# EAGLE schematic bb8 (EAGLE 6.4)
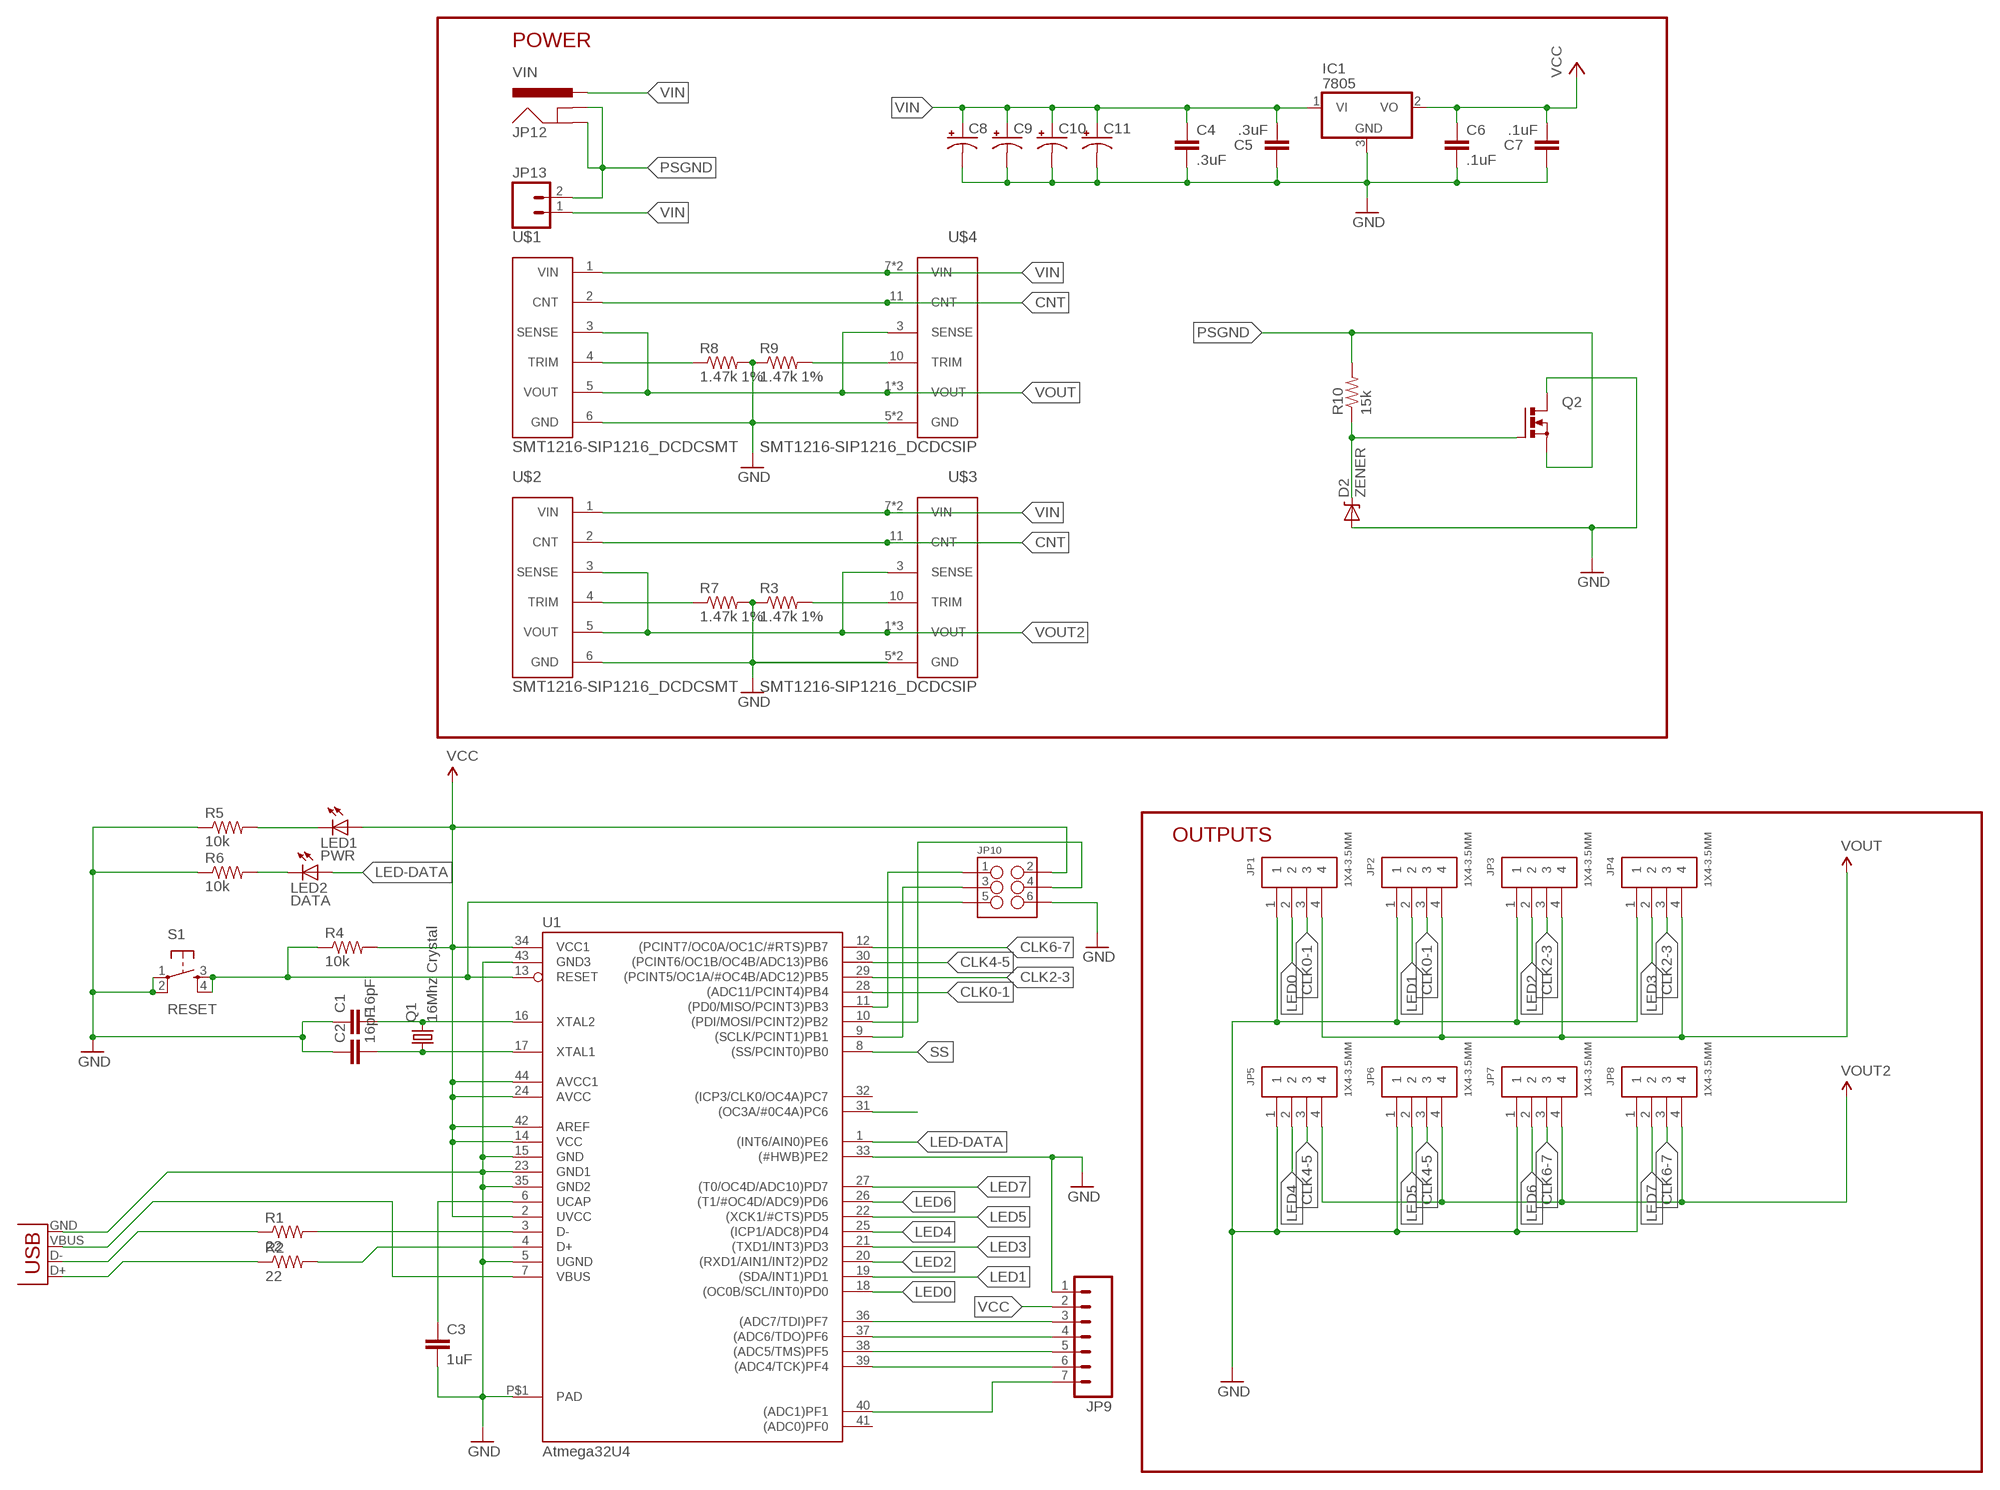
[diagram p0: schematic, sheet 1]

## Parts
C1  16pF  CAP0805  [0805]
C2  16pF  CAP0805  [0805]
C3  1uF  1UF-25V-10%(0805)  [0805]
C4  .3uF  CAP1210  [1210]
C5  .3uF  CAP0805  [0805]
C6  .1uF  CAP1210  [1210]
C7  .1uF  CAP0805  [0805]
C8  CAP_POLE  [PANASONIC_E]
C9  CAP_POLE  [PANASONIC_E]
C10  CAP_POLE  [PANASONIC_E]
C11  CAP_POLE  [PANASONIC_E]
D2  ZENER  DIODE-ZENER-BZT52  [SOD-323]
IC1  7805  7806DT  [TO252]
JP1  1X4-3.5MM  [1X04-3.5MM]
JP2  1X4-3.5MM  [1X04-3.5MM]
JP3  1X4-3.5MM  [1X04-3.5MM]
JP4  1X4-3.5MM  [1X04-3.5MM]
JP5  1X4-3.5MM  [1X04-3.5MM]
JP6  1X4-3.5MM  [1X04-3.5MM]
JP7  1X4-3.5MM  [1X04-3.5MM]
JP8  1X4-3.5MM  [1X04-3.5MM]
JP9  M07  [1X07]
JP10  M03X2POGO_PINS  [2X3_POGO]
JP11  USB-B  USBPTH  [USB-B-PTH]
JP12  VIN  POWER_JACKPTH_LOCK  [POWER_JACK_PTH_LOCK]
JP13  M025MM  [SCREWTERMINAL-5MM-2]
LED1  PWR  LED3MM  [LED3MM]
LED2  DATA  LED3MM  [LED3MM]
Q1  16Mhz Crystal  CRYSTAL  [XS3225]
Q2  PMOSFET_NTO220BV  [TO220BV]
R1  22  RESISTOR0805-RES  [0805]
R2  22  RESISTOR0805-RES  [0805]
R3  1.47k 1%  RESISTOR0805-RES  [0805]
R4  10k  RESISTOR0805-RES  [0805]
R5  10k  RESISTOR0805-RES  [0805]
R6  10k  RESISTOR0805-RES  [0805]
R7  1.47k 1%  RESISTOR0805-RES  [0805]
R8  1.47k 1%  RESISTOR0805-RES  [0805]
R9  1.47k 1%  RESISTOR0805-RES  [0805]
R10  15k  RESISTOR0805-RES  [0805]
S1  RESET  TAC_SWITCHSMD  [TACTILE_SWITCH_SMD]
U1  Atmega32U4  ARDUINO_LEONARDO-REV3B_SMARTPRJ_ATMEGA32U4-XUAU  [ARDUINO_LEONARDO-REV3B_SMARTPRJ_TQFP44-PAD]
U$1  SMT1216-SIP1216_DCDCSMT  [SMT1216_DCDC]
U$2  SMT1216-SIP1216_DCDCSMT  [SMT1216_DCDC]
U$3  SMT1216-SIP1216_DCDCSIP  [SIP1216_DCDC]
U$4  SMT1216-SIP1216_DCDCSIP  [SIP1216_DCDC]

## Nets
CLK0-1: JP1.3 JP2.3 U1.28((ADC11/PCINT4)PB4)
CLK2-3: JP3.3 JP4.3 U1.29((PCINT5/OC1A/#OC4B/ADC12)PB5)
CLK4-5: JP5.3 JP6.3 U1.30((PCINT6/OC1B/OC4B/ADC13)PB6)
CLK6-7: JP7.3 JP8.3 U1.12((PCINT7/OC0A/OC1C/#RTS)PB7)
CNT: U1.31((OC3A/#0C4A)PC6) U$1.2(CNT) U$2.2(CNT) U$3.11(CNT) U$4.11(CNT)
D2: LED1.K(C) R5.2
GND: C1.1 C2.1 C3.2 C4.2 C5.1 C6.2 C7.1 C8.- C9.- C10.- C11.- D2.2(A) IC1.3(GND) JP1.1 JP2.1 JP3.1 JP4.1 JP5.1 JP6.1 JP7.1 JP8.1 JP9.1 JP10.P$6 JP11.GND Q2.D R3.1 R5.1 R6.1 R7.2 R8.2 R9.1 S1.1 S1.2 U1.5(UGND) U1.15(GND) U1.23(GND1) U1.33((#HWB)PE2) U1.35(GND2) U1.43(GND3) U1.P$1(PAD) U$1.6(GND) U$2.6(GND) U$3.5(GND) U$3.6(GND) U$4.5(GND) U$4.6(GND)
LED0: JP1.2 U1.18((OC0B/SCL/INT0)PD0)
LED1: JP2.2 U1.19((SDA/INT1)PD1)
LED2: JP3.2 U1.20((RXD1/AIN1/INT2)PD2)
LED3: JP4.2 U1.21((TXD1/INT3)PD3)
LED4: JP5.2 U1.25((ICP1/ADC8)PD4)
LED5: JP6.2 U1.22((XCK1/#CTS)PD5)
LED6: JP7.2 U1.26((T1/#OC4D/ADC9)PD6)
LED7: JP8.2 U1.27((T0/OC4D/ADC10)PD7)
LED-DATA: LED2.A U1.1((INT6/AIN0)PE6)
MISO: JP10.P$1 U1.11((PD0/MISO/PCINT3)PB3)
MOSI: JP10.P$4 U1.10((PDI/MOSI/PCINT2)PB2)
N$1: C1.2 Q1.P$3 U1.16(XTAL2)
N$2: C2.2 Q1.P$1 U1.17(XTAL1)
N$3: R2.2 U1.4(D+)
N$4: JP11.D+ R2.1
N$5: R1.2 U1.3(D-)
N$6: JP11.D- R1.1
N$7: C3.1 U1.6(UCAP)
N$9: LED2.K(C) R6.2
N$11: JP9.3 U1.36((ADC7/TDI)PF7)
N$12: JP9.4 U1.37((ADC6/TDO)PF6)
N$13: JP9.5 U1.38((ADC5/TMS)PF5)
N$14: JP9.6 U1.39((ADC4/TCK)PF4)
N$15: JP9.7 U1.40((ADC1)PF1)
N$16: D2.1(C) Q2.G R10.1
N$17: R9.2 U$4.10(TRIM)
N$18: R7.1 U$2.4(TRIM)
N$19: R3.2 U$3.10(TRIM)
N$20: R8.1 U$1.4(TRIM)
PSGND: JP12.GND JP12.GNDBREAK JP13.2 Q2.S R10.2
RST: JP10.P$5 R4.1 S1.3 S1.4 U1.13(RESET)
SCLK: JP10.P$3 U1.9((SCLK/PCINT1)PB1)
SS: U1.8((SS/PCINT0)PB0)
VCC: C6.1 C7.2 IC1.2(VO) JP9.2 JP10.P$2 LED1.A R4.2 U1.2(UVCC) U1.14(VCC) U1.24(AVCC) U1.34(VCC1) U1.42(AREF) U1.44(AVCC1)
VIN: C4.1 C5.2 C8.+ C9.+ C10.+ C11.+ IC1.1(VI) JP12.PWR JP13.1 U$1.1(VIN) U$2.1(VIN) U$3.7(VIN) U$3.8(VIN) U$4.7(VIN) U$4.8(VIN)
VOUT: JP1.4 JP2.4 JP3.4 JP4.4 U$1.3(SENSE) U$1.5(VOUT) U$4.1(VOUT) U$4.2(VOUT) U$4.3(SENSE) U$4.4(VOUT)
VOUT2: JP5.4 JP6.4 JP7.4 JP8.4 U$2.3(SENSE) U$2.5(VOUT) U$3.1(VOUT) U$3.2(VOUT) U$3.3(SENSE) U$3.4(VOUT)
VUSB: JP11.VBUS U1.7(VBUS)
Unconnected: U1.32((ICP3/CLK0/OC4A)PC7) U1.41((ADC0)PF0)

## Notes on the sheet
- POWER
- OUTPUTS

## Library data of the parts
C1 C2 = SparkFun-Passives:CAP: Capacitor Standard 0603 ceramic capacitor, and 0.1" leaded capacitor.
C3 = SparkFun-Capacitors:1UF-25V-10%(0805): CAP-08064; PROD_ID: CAP-08064
C4-C7 = SparkFun:CAP: Capacitor Standard 0603 ceramic capacitor, and 0.1" leaded capacitor.
C8-C11 = SparkFun-Capacitors:CAP_POL: Capacitor Polarized These are standard SMD and PTH capacitors. Normally 10uF, 47uF, and 100uF in electrolytic and tantalum varieties. Always verify the external diameter of the through hole cap, it varies with capacity, voltage, and manufacturer. The EIA devices should be standard.
D2 = SparkFun-DiscreteSemi:DIODE-ZENER: Zener Diode Production Part - 8199 3.4V Zener Voltage
IC1 = adafruit:78*: Positive VOLTAGE REGULATOR Added bigger pads to the TO-92 package
JP1-JP8 = adafruit:1X4: 4-pin connector
JP9 = SparkFun-Connectors:M07: Header 7 Standard 7-pin 0.1" header. Use with straight break away headers (SKU : PRT-00116), right angle break away headers (PRT-00553), swiss pins (PRT-00743), machine pins (PRT-00117), and female headers (PRT-00115). NOTES ON THE VARIANTS LOCK and LOCK_LONGPADS... This footprint was designed to help hold the alignment of a through-hole component (i.e. 7-pin header) while soldering it into place. You may notice that each hole has been shifted either up or down by 0.005 of an inch from it's more standard position (which is usually a perfectly straight line). This slight alteration caused the pins (the squares in the middle) to touch the edges of the holes. Because they are alternating, it causes a "brace" to hold the header in place. 0.005 has proven to be the perfect amount of "off-center" position when using our standard breakaway headers. Although looks a little odd when you look at the bare footprint, once you have a header in there, the alteration is very hard to notice. Also, if you push a header all the way into place, it is covered up entirely on the bottom side. This idea of altering the position of holes to aid alignment will be further integrated into the Sparkfun Library for other footprints. It can help hold any component with 3 or more connection pins.
JP10 = SparkFun-Connectors:M03X2: 2x3 .1" header. Shrouded, with keying- CONN-10681 SMT- CONN-11415 Pogo pins- HW-11044; PROD_ID: HW-11044
JP11 = SparkFun-Connectors:USB: USB Connectors USB-B-PTH is fully proven SKU : PRT-00139/CONN-08278 USB-miniB is fully proven SKU : PRT-00587 USB-A-PCB is untested. USB-A-H is throughly reviewed, but untested. Spark Fun Electronics SKU : PRT-00437 USB-B-SMT is throughly reviewed, but untested. Needs silkscreen touching up. USB-A-S has not been used/tested USB-MB-H has not been used/tested USB-MICROB has been used. CONN-09505; PROD_ID: CONN-08278
JP12 = SparkFun-Connectors:POWER_JACK: Power Jack This is the standard 5.5mm barrel jack for power. The PTH is the most common, proven, reliable, footprint. The Slot footprint only works if the mill layer is transmitted to the PCB fab house so be warned. Spark Fun Electronics SKU : PRT-00119 SMT: CONN-08106 Mating wall wart : TOL-00298 (and others)
JP13 = SparkFun-Connectors:M02: Header 2 Standard 2-pin 0.1" header. Use with straight break away headers (SKU : PRT-00116), right angle break away headers (PRT-00553), swiss pins (PRT-00743), machine pins (PRT-00117), and female headers (PRT-00115). Molex polarized connector foot print use with SKU : PRT-08233 with associated crimp pins and housings.
LED1 LED2 = SparkFun-LED:LED: LEDs Standard schematic elements and footprints for 5mm, 3mm, 1206, and 0603 sized LEDs. 5mm - Spark Fun Electronics SKU : COM-00529 (and others)
Q1 = blinkiverse:CRYSTAL: CRYSTAL
Q2 = transistor-power:PMOSFET_N: Power MOSFET N-Channel
R1-R10 = SparkFun-Passives:RESISTOR: Resistor Basic schematic elements and footprints for 0603, 1206, and PTH resistors.
S1 = SparkFun-Electromechanical:TAC_SWITCH: Momentary Switch Button commonly used for reset or general input. Spark Fun Electronics SKU : COM-00097 SMT- SWCH-08247; PROD_ID: SWCH-08247
U1 = blinkiverse:ARDUINO_LEONARDO-REV3B_SMARTPRJ_ATMEGA32U4-XU
U$1-U$4 = blinkiverse:SMT1216-SIP1216_DCDC

## Net classes
0 default: width 0.305 mm, clearance 0.305 mm
1 power: width 3.124 mm, clearance 0.635 mm